# EAGLE design untitled (EAGLE 5.11)
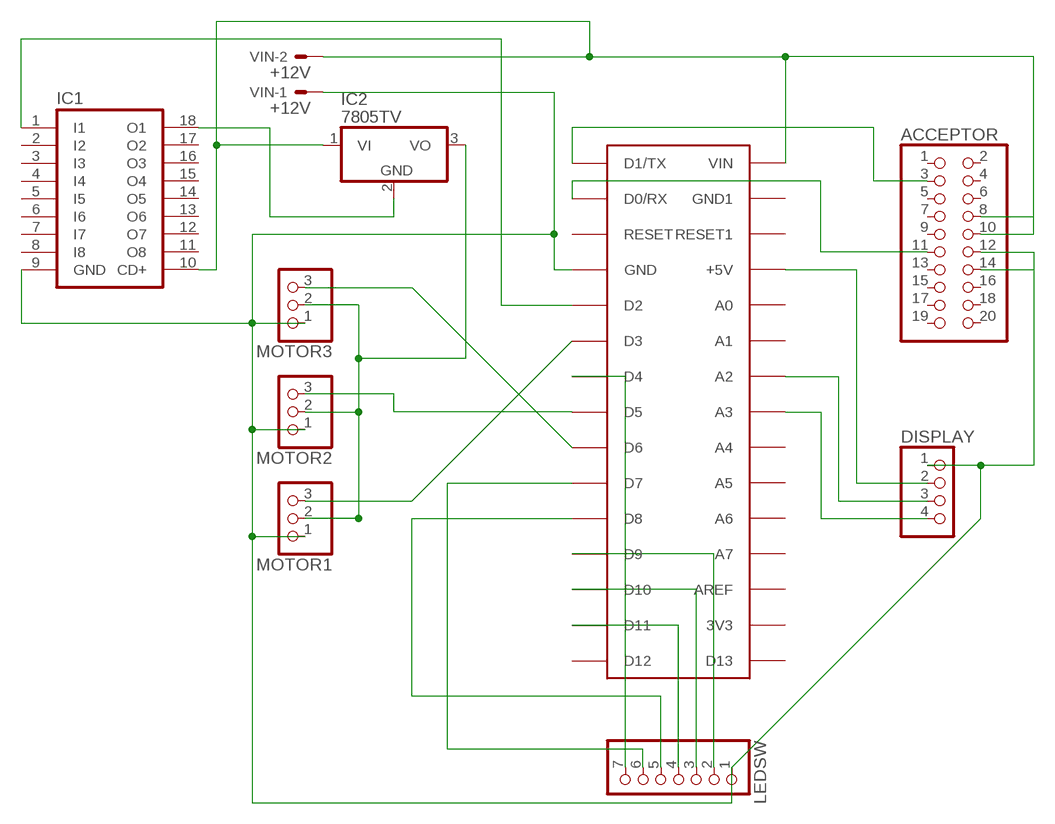
[diagram p0: schematic, sheet 1]

## Parts
ACCEPTOR  PINHD-2X10  [2X10]
DISPLAY  PINHD-1X4  [1X04]
IC1  ULN2803A  [DIL18]
IC2  7805TV  [TO220V]
LEDSW  PINHD-1X7  [1X07]
MOTOR1  PINHD-1X3  [1X03]
MOTOR2  PINHD-1X3  [1X03]
MOTOR3  PINHD-1X3  [1X03]
NANO  ARDUINONANO  [PDIP-32]
VIN  +12V  KK-156-2  [KK-156-2]

## Nets
N$1: ACCEPTOR.8 ACCEPTOR.10 IC1.10(CD+) IC2.1(VI) NANO.VIN VIN.2
N$2: DISPLAY.3 NANO.A2
N$3: IC2.3(VO) MOTOR1.2 MOTOR2.2 MOTOR3.2
N$4: MOTOR1.3 NANO.D3
N$5: MOTOR2.3 NANO.D5
N$6: MOTOR3.3 NANO.D6
N$7: IC1.18(O1) IC2.2(GND)
N$8: ACCEPTOR.3 NANO.D1/TX
N$9: DISPLAY.4 NANO.A3
N$10: DISPLAY.2 NANO.+5V
N$11: IC1.1(I1) NANO.D2
N$12: ACCEPTOR.11 NANO.D0/RX
N$14: LEDSW.2 NANO.D9
N$15: LEDSW.3 NANO.D10
N$16: LEDSW.4 NANO.D11
N$17: LEDSW.5 NANO.D8
N$18: LEDSW.6 NANO.D7
N$19: LEDSW.7 NANO.D4
N$20: ACCEPTOR.12 ACCEPTOR.14 DISPLAY.1 IC1.9(GND) LEDSW.1 MOTOR1.1 MOTOR2.1 MOTOR3.1 NANO.GND VIN.1
Unconnected: ACCEPTOR.1 ACCEPTOR.2 ACCEPTOR.4 ACCEPTOR.5 ACCEPTOR.6 ACCEPTOR.7 ACCEPTOR.9 ACCEPTOR.13 ACCEPTOR.15 ACCEPTOR.16 ACCEPTOR.17 ACCEPTOR.18 ACCEPTOR.19 ACCEPTOR.20 IC1.2(I2) IC1.3(I3) IC1.4(I4) IC1.5(I5) IC1.6(I6) IC1.7(I7) IC1.8(I8) IC1.11(O8) IC1.12(O7) IC1.13(O6) IC1.14(O5) IC1.15(O4) IC1.16(O3) IC1.17(O2) NANO.3V3 NANO.A0 NANO.A1 NANO.A4 NANO.A5 NANO.A6 NANO.A7 NANO.AREF NANO.D12 NANO.D13 NANO.GND1 NANO.RESET NANO.RESET1

## Library data of the parts
ACCEPTOR = pinhead:PINHD-2X10: PIN HEADER
DISPLAY = pinhead:PINHD-1X4: PIN HEADER
IC1 = uln-udn:ULN2803A: DRIVER ARRAY
IC2 = linear:78*: Positive VOLTAGE REGULATOR Source: http://cache.national.com/ds/LM/LM78L05.pdf http://www.fairchildsemi.com/ds/LM/LM7805.pdf
LEDSW = pinhead:PINHD-1X7: PIN HEADER
MOTOR1-MOTOR3 = pinhead:PINHD-1X3: PIN HEADER
NANO = moeffe:ARDUINONANO
VIN = con-molex:KK-156-2: KK 156 HEADER Source: http://www.molex.com/pdm_docs/sd/026604100_sd.pdf; OC_FARNELL: unknown; OC_NEWARK: unknown

## Board
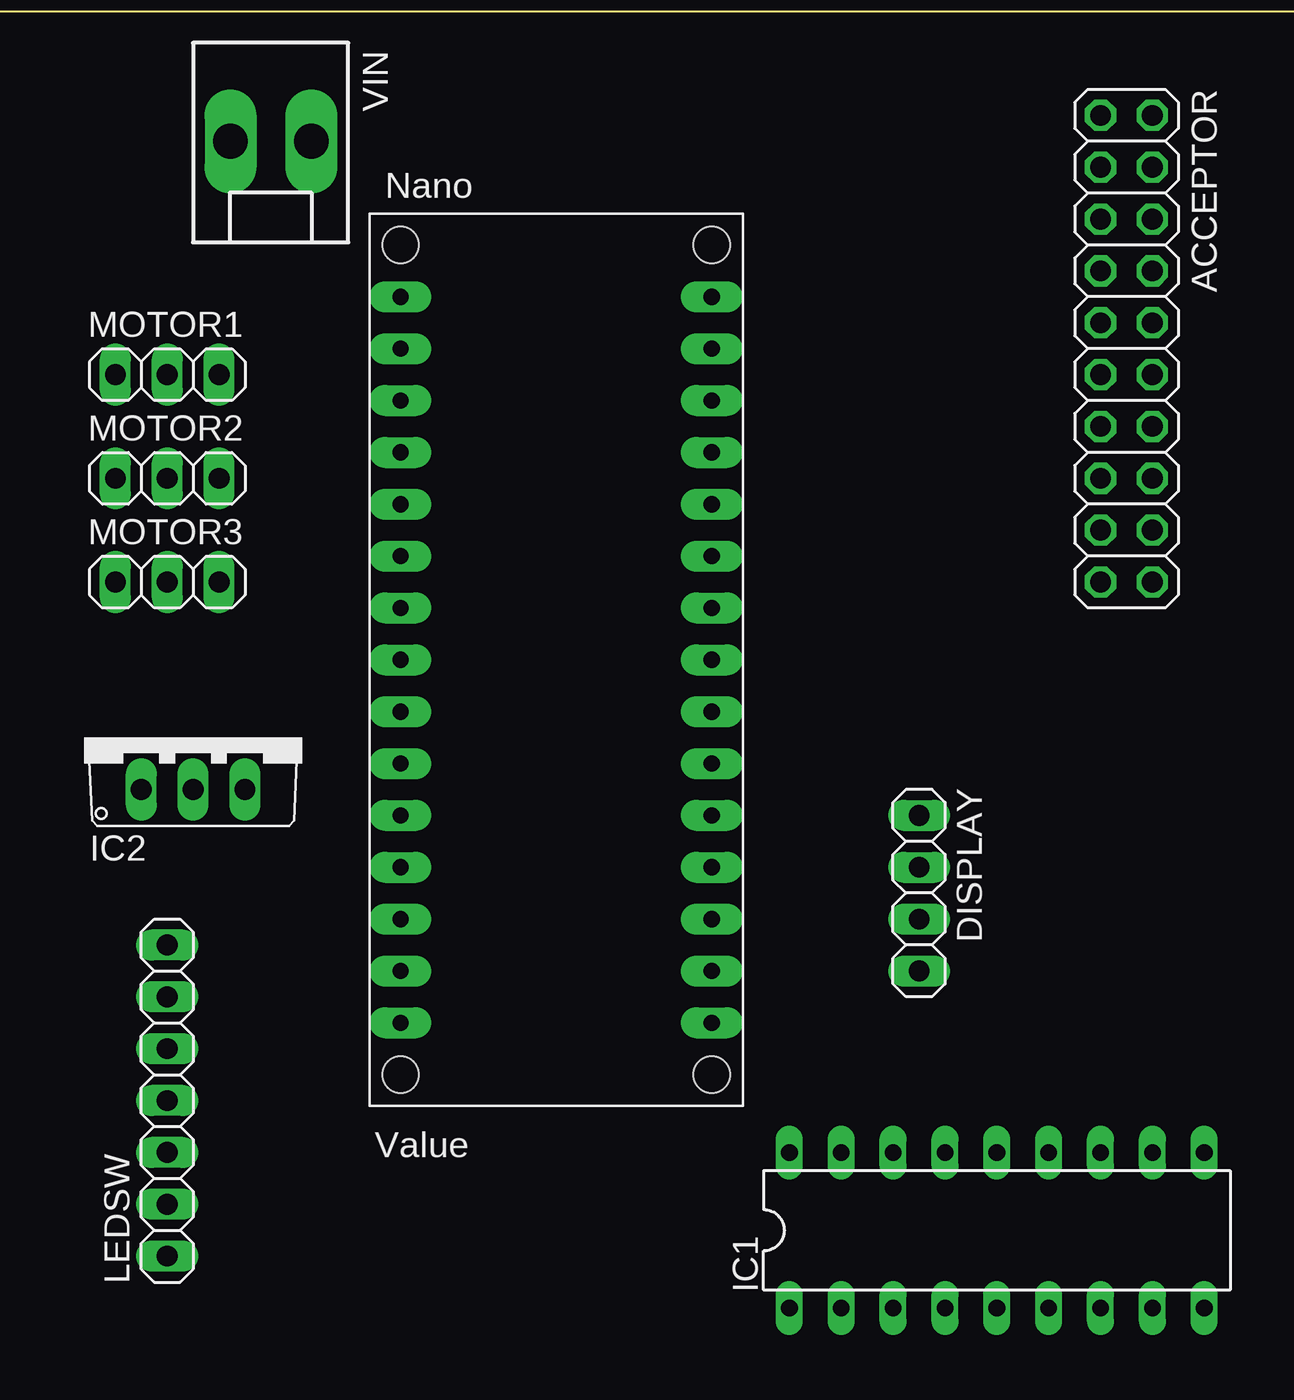
[diagram p1: board, top side]
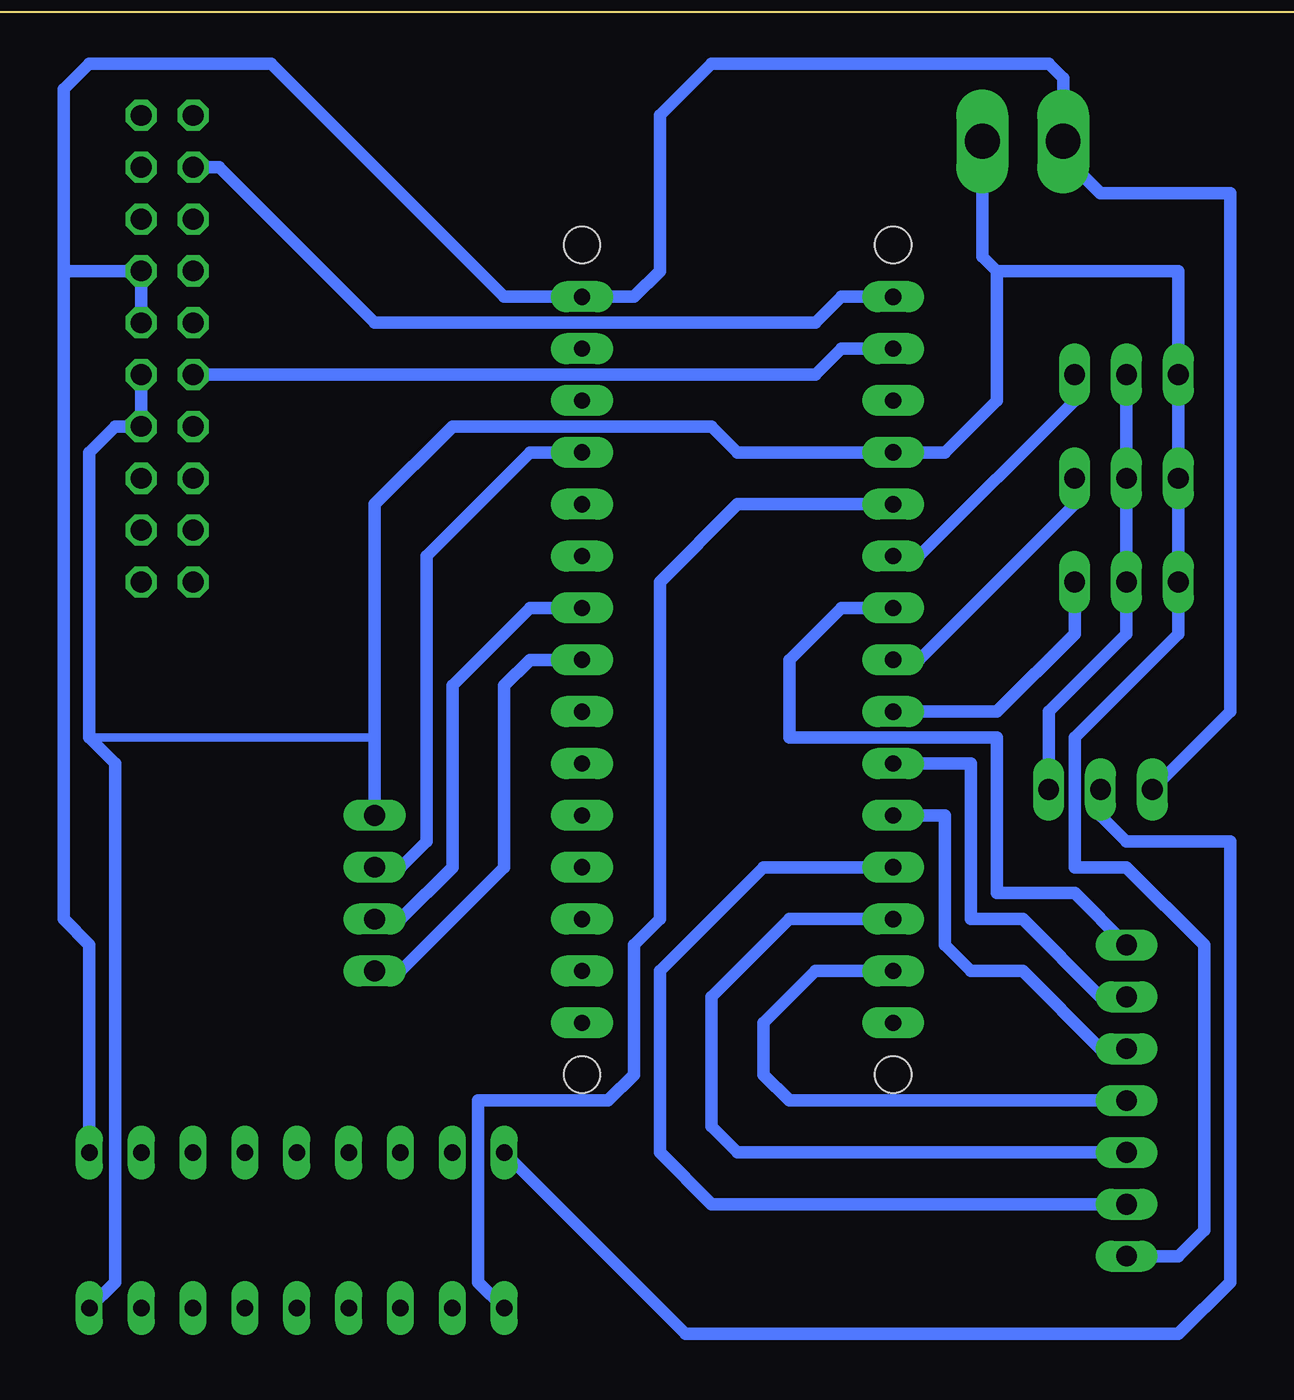
[diagram p2: board, bottom side, seen from below]

No outline drawn. Coordinates in mm, seen from the top.
Copper layers (1*16): Top 0.035mm / dielectric 1.5mm / Bottom 0.035mm
Design rules "default": minimum track width 10mil, minimum drill 24mil, track to track 8mil, track to pad 8mil, pad to pad 8mil, via to via 8mil, smd to smd 8mil, copper to edge 40mil, drill to drill 8mil, minimum pad ring 10mil, minimum via ring 8mil, stop-mask expansion 4mil, vias tented up to drill 0mil, thermal gap 10mil
Milling: 4 lines

### Footprints (pad centres in the part's own frame; a part is rotated, then mirrored left to right if it is on the bottom)
2X10 = drill 1.016 octagon: 1 -11.43,-1.27; 2 -11.43,1.27; 3 -8.89,-1.27; 4 -8.89,1.27; 5 -6.35,-1.27; 6 -6.35,1.27; 7 -3.81,-1.27; 8 -3.81,1.27; 9 -1.27,-1.27; 10 -1.27,1.27; 11 1.27,-1.27; 12 1.27,1.27; 13 3.81,-1.27; 14 3.81,1.27; 15 6.35,-1.27; 16 6.35,1.27; 17 8.89,-1.27; 18 8.89,1.27; 19 11.43,-1.27; 20 11.43,1.27
1X04 = drill 1.016 long: 1 -3.81,0; 2 -1.27,0; 3 1.27,0; 4 3.81,0
DIL18 = drill 0.813 long: 1 -10.16,-3.81; 2 -7.62,-3.81; 3 -5.08,-3.81; 4 -2.54,-3.81; 5 0,-3.81; 6 2.54,-3.81; 7 5.08,-3.81; 8 7.62,-3.81; 9 10.16,-3.81; 10 10.16,3.81; 11 7.62,3.81; 12 5.08,3.81; 13 2.54,3.81; 14 0,3.81; 15 -2.54,3.81; 16 -5.08,3.81; 17 -7.62,3.81; 18 -10.16,3.81
TO220V = drill 1.016 long: 1 -2.54,-2.54; 2 0,-2.54; 3 2.54,-2.54
1X07 = drill 1.016 long: 1 -7.62,0; 2 -5.08,0; 3 -2.54,0; 4 0,0; 5 2.54,0; 6 5.08,0; 7 7.62,0
1X03 = drill 1.016 long: 1 -2.54,0; 2 0,0; 3 2.54,0
PDIP-32 = drill 0.8 pad 1.524 long: 3V3 15.24,-35.56; +5V 15.24,-10.16; A0 15.24,-12.7; A1 15.24,-15.24; A2 15.24,-17.78; A3 15.24,-20.32; A4 15.24,-22.86; A5 15.24,-25.4; A6 15.24,-27.94; A7 15.24,-30.48; AREF 15.24,-33.02; D0/RX 0,-5.08; D1/TX 0,-2.54; D2 0,-12.7; D3 0,-15.24; D4 0,-17.78; D5 0,-20.32; D6 0,-22.86; D7 0,-25.4; D8 0,-27.94; D9 0,-30.48; D10 0,-33.02; D11 0,-35.56; D12 0,-38.1; D13 15.24,-38.1; GND 0,-10.16; GND1 15.24,-5.08; RESET 0,-7.62; RESET1 15.24,-7.62; VIN 15.24,-2.54 | hole 1.778: 0,0; 0,-40.64; 15.24,-40.64; 15.24,0
KK-156-2 = drill 1.7 pad 2.184 long: 1 -1.98,0; 2 1.98,0

### Placement (x,y rotation side)
ACCEPTOR  69.85,60.96 270 top
DISPLAY  59.69,34.29 270 top
IC1  63.5,17.78 0 top
IC2  24.13,41.91 0 top
LEDSW  22.86,24.13 90 top
MOTOR1  22.86,59.69 0 top
MOTOR2  22.86,54.61 0 top
MOTOR3  22.86,49.53 0 top
NANO  34.29,66.04 0 top
VIN  27.94,71.12 180 top

### Tracks (layer width: path | path; a pad name or v marks a point on that pad's centre or on a via)
N$1
  Bottom 0.61: 74.93,64.77 74.93,73.66 73.66,74.93 64.77,74.93 53.34,63.5 NANO.VIN 46.99,63.5 45.72,64.77 45.72,72.39 43.18,74.93 26.67,74.93 25.96,74.22 VIN.2 25.96,70.41 24.13,68.58 17.78,68.58 17.78,43.18 IC2.1 | 74.93,64.77 74.93,33.02 73.66,31.75 IC1.10 | ACCEPTOR.10 ACCEPTOR.8 74.93,64.77
N$2
  Bottom 0.61: DISPLAY.3 58.42,33.02 55.88,35.56 55.88,44.45 52.07,48.26 NANO.A2
N$3
  Bottom 0.61: MOTOR1.2 MOTOR2.2 MOTOR3.2 22.86,46.99 26.67,43.18 IC2.3
N$4
  Bottom 0.61: MOTOR1.3 25.4,58.42 33.02,50.8 NANO.D3
N$5
  Bottom 0.61: MOTOR2.3 25.4,53.34 33.02,45.72 NANO.D5
N$6
  Bottom 0.61: MOTOR3.3 25.4,46.99 29.21,43.18 NANO.D6
N$7
  Bottom 0.61: IC2.2 24.13,38.1 22.86,36.83 17.78,36.83 17.78,15.24 20.32,12.7 44.45,12.7 IC1.18
N$8
  Bottom 0.61: ACCEPTOR.3 67.31,69.85 59.69,62.23 38.1,62.23 36.83,63.5 NANO.D1/TX
N$9
  Bottom 0.61: DISPLAY.4 58.42,30.48 53.34,35.56 53.34,44.45 52.07,45.72 NANO.A3
N$10
  Bottom 0.61: DISPLAY.2 58.42,35.56 57.15,36.83 57.15,50.8 52.07,55.88 NANO.+5V
N$11
  Bottom 0.61: NANO.D2 41.91,53.34 45.72,49.53 45.72,33.02 46.99,31.75 46.99,25.4 48.26,24.13 54.61,24.13 54.61,15.24 IC1.1
N$12
  Bottom 0.61: ACCEPTOR.11 38.1,59.69 36.83,60.96 NANO.D0/RX
N$14
  Bottom 0.61: LEDSW.2 43.18,19.05 45.72,21.59 45.72,30.48 40.64,35.56 NANO.D9
N$15
  Bottom 0.61: LEDSW.3 41.91,21.59 43.18,22.86 43.18,29.21 39.37,33.02 NANO.D10
N$16
  Bottom 0.61: LEDSW.4 39.37,24.13 40.64,25.4 40.64,27.94 38.1,30.48 NANO.D11
N$17
  Bottom 0.61: LEDSW.5 24.13,26.67 27.94,30.48 30.48,30.48 31.75,31.75 31.75,38.1 NANO.D8
N$18
  Bottom 0.61: LEDSW.6 24.13,29.21 27.94,33.02 30.48,33.02 30.48,40.64 NANO.D7
N$19
  Bottom 0.61: LEDSW.7 25.4,34.29 29.21,34.29 29.21,41.91 39.37,41.91 39.37,45.72 36.83,48.26 NANO.D4
N$20
  Bottom 0.406: 59.69,41.91 73.66,41.91
  Bottom 0.61: 29.21,64.77 29.92,65.48 VIN.1 | 29.21,64.77 20.32,64.77 MOTOR1.1 MOTOR2.1 MOTOR3.1 20.32,46.99 25.4,41.91 25.4,35.56 22.86,35.56 19.05,31.75 19.05,17.78 20.32,16.51 LEDSW.1 | 29.21,64.77 29.21,58.42 31.75,55.88 NANO.GND 41.91,55.88 43.18,57.15 55.88,57.15 59.69,53.34 59.69,41.91 DISPLAY.1 | IC1.9 72.39,15.24 72.39,40.64 73.66,41.91 73.66,55.88 72.39,57.15 ACCEPTOR.14 ACCEPTOR.12